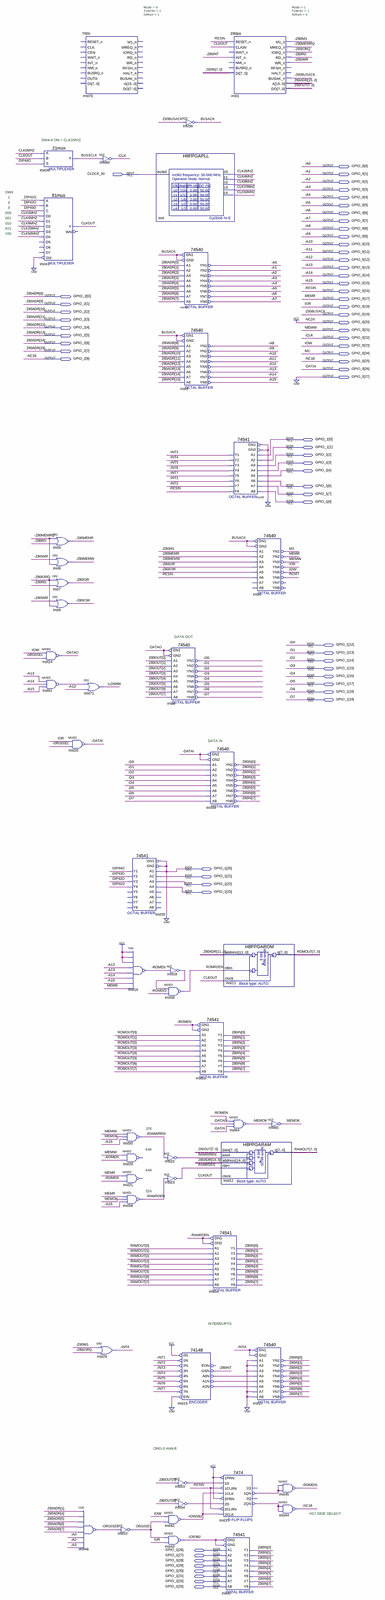
[diagram p0: schematic sheet, whole]
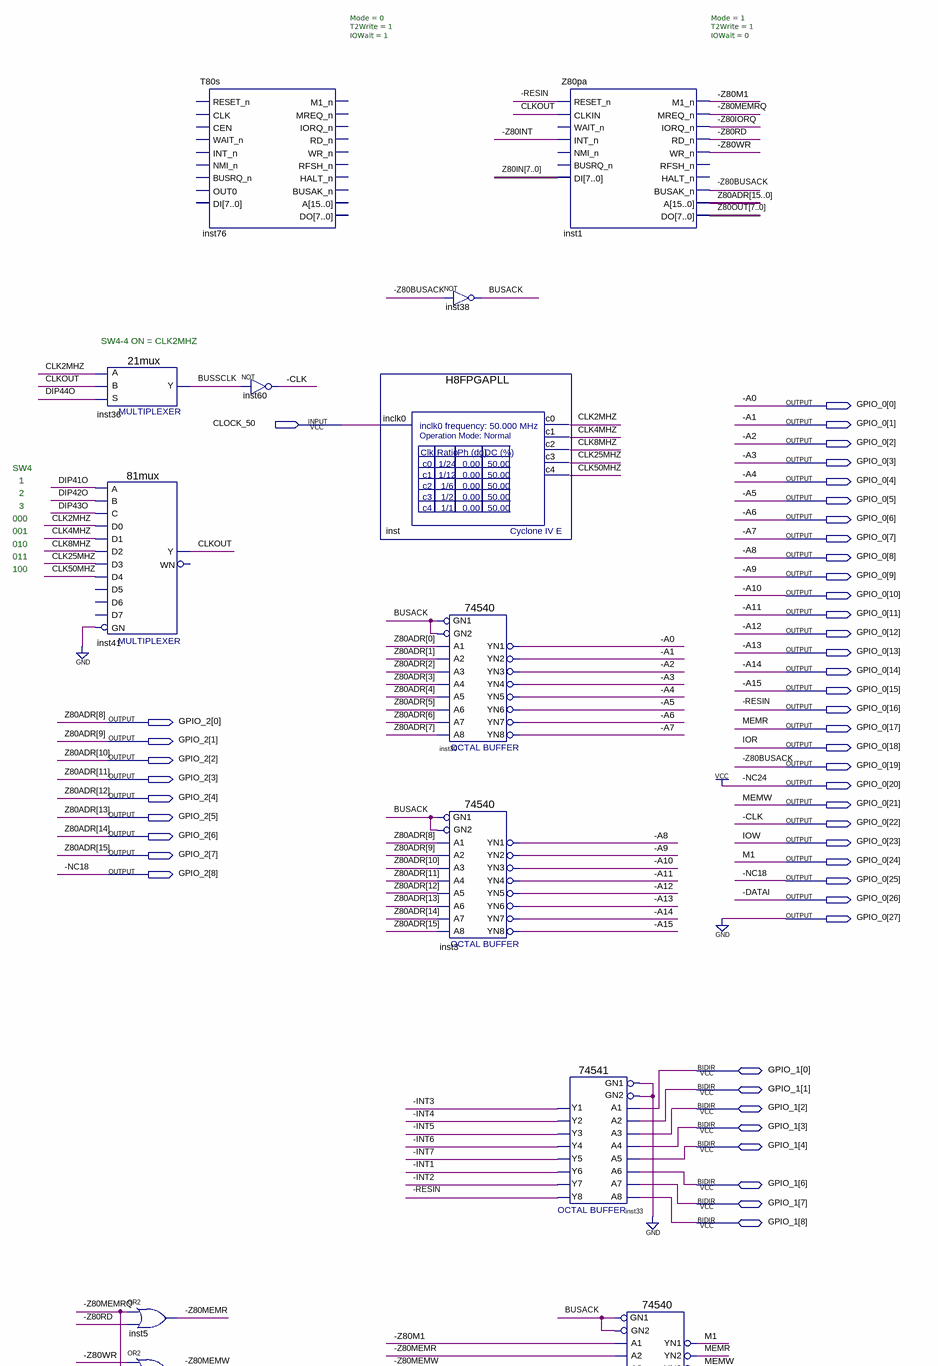
[diagram p1: schematic sheet, upper part]
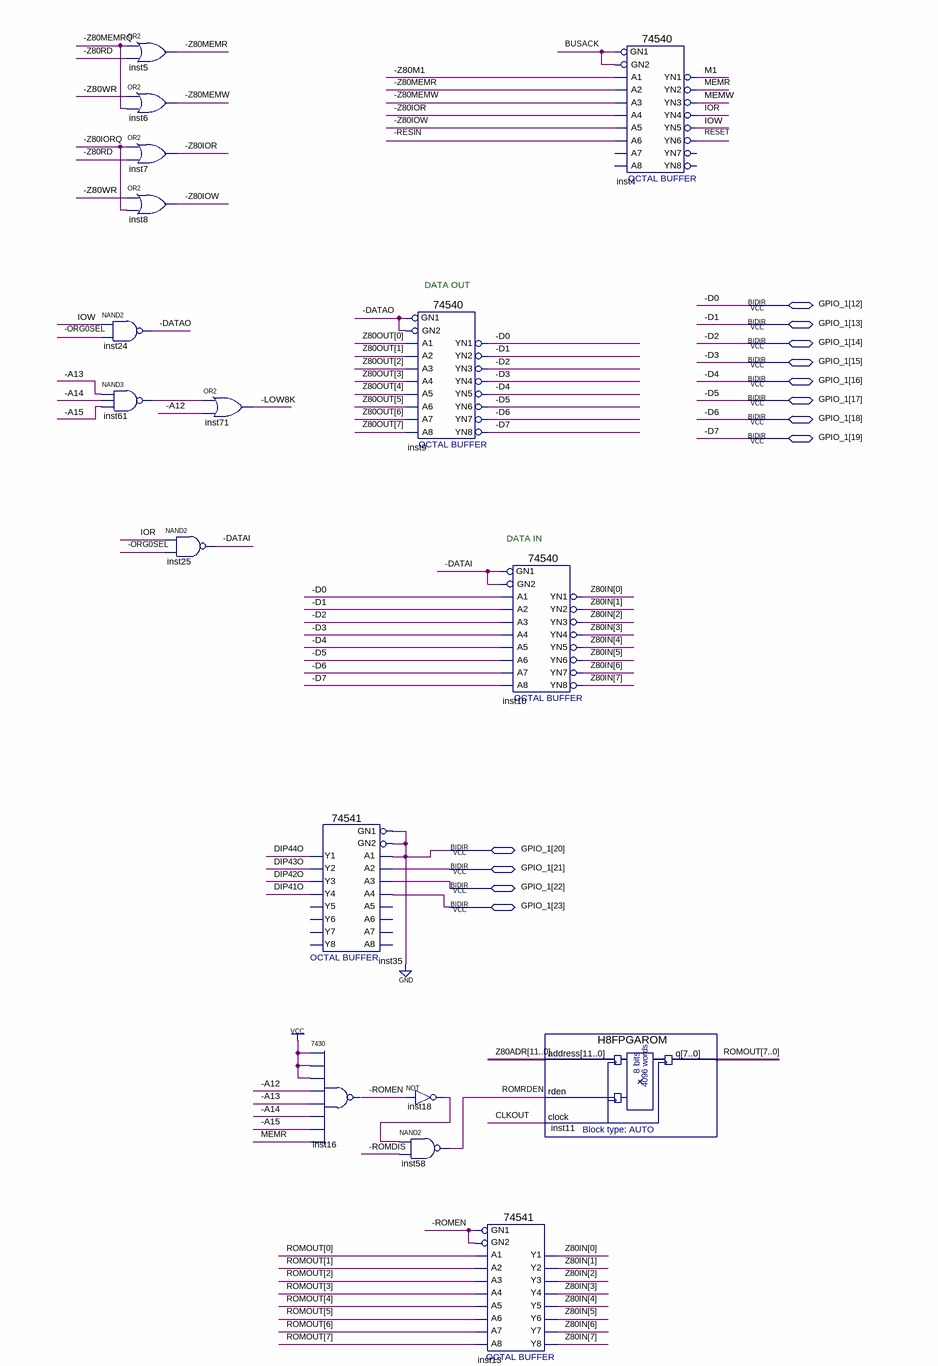
[diagram p2: schematic sheet, middle part]
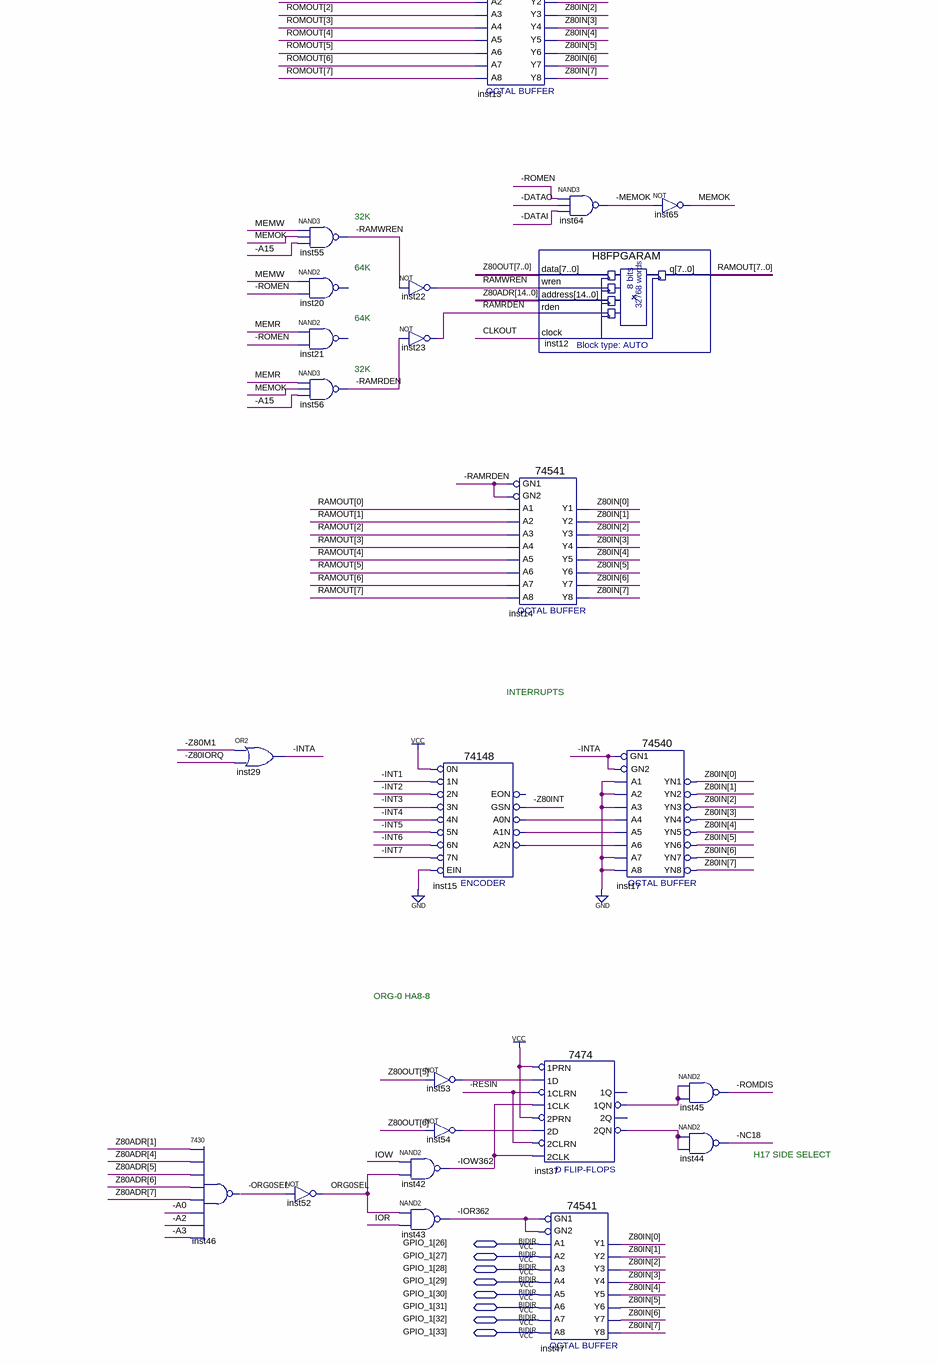
[diagram p3: schematic sheet, lower part]
// Quartus schematic H8FPGA.bdf as structural Verilog: 50 symbols, 66 pins
module H8FPGA (
  input  CLOCK_50,
  inout  [33:0] GPIO_1,
  output [27:0] GPIO_0,
  output [8:0] GPIO_2
);

  wire \-DATAO , \-INT1 , \-INT2 , \-INT3 , \-INT4 , \-INT5 , \-INT6 , \-INT7 , \-INTA , \-IOR362 ,
       \-IOW362 , \-LOW8K , \-MEMOK , \-ORG0SEL , \-RAMRDEN , \-RAMWREN , \-ROMDIS , \-ROMEN , \-Z80INT ,
       \-Z80IOR , \-Z80IORQ , \-Z80IOW , \-Z80M1 , \-Z80MEMR , \-Z80MEMRQ , \-Z80MEMW , \-Z80RD , \-Z80WR ,
       BUSACK, BUSSCLK, CLK2MHZ, CLK4MHZ, CLK8MHZ, CLK25MHZ, CLK50MHZ, CLKOUT, DIP41O, DIP42O, DIP43O,
       DIP44O, inst15_a0n, inst15_a1n, inst15_a2n, inst18_out, inst37_1qn, inst37_2qn, inst53_out,
       inst54_out, inst61_out, MEMOK, ORG0SEL, RAMRDEN, RAMWREN, RESET, ROMRDEN;
  wire [7:0] RAMOUT, ROMOUT, Z80ADR, Z80IN, Z80OUT;

  \21mux  inst36 (.S(DIP44O), .B(CLKOUT), .A(CLK2MHZ), .Y(BUSSCLK));
  \81mux  inst41 (
    .C(DIP43O), .D1(CLK4MHZ), .D0(CLK2MHZ), .D4(CLK50MHZ), .D2(CLK8MHZ), .D3(CLK25MHZ), .GN(1'b0),
    .A(DIP41O), .B(DIP42O), .Y(CLKOUT));  // open: D5, D7, D6, WN
  or inst5 (\-Z80MEMR , \-Z80MEMRQ , \-Z80RD );
  or inst6 (\-Z80MEMW , \-Z80WR , \-Z80MEMRQ );
  or inst7 (\-Z80IOR , \-Z80IORQ , \-Z80RD );
  or inst8 (\-Z80IOW , \-Z80WR , \-Z80IORQ );
  nand inst24 (\-DATAO , GPIO_0[23], \-ORG0SEL );
  nand inst61 (inst61_out, GPIO_0[13], GPIO_0[14], GPIO_0[15]);
  nand inst25 (GPIO_0[26], GPIO_0[18], \-ORG0SEL );
  T80s #(.Mode(0), .T2Write(1), .IOWait(1)) inst76 ();  // open: RESET_n, CLK, CEN, WAIT_n, INT_n, NMI_n, BUSRQ_n, OUT0, DI, M1_n, MREQ_n, IORQ_n, RD_n, WR_n, RFSH_n, HALT_n, BUSAK_n, A, DO
  or inst71 (\-LOW8K , inst61_out, GPIO_0[12]);
  or inst29 (\-INTA , \-Z80M1 , \-Z80IORQ );
  \7430  inst46 (
    .\9 (GPIO_0[3]), .\7 (GPIO_0[0]), .\8 (GPIO_0[2]), .\5 (Z80ADR[6]), .\2 (Z80ADR[1]), .\6 (Z80ADR[7]),
    .\3 (Z80ADR[4]), .\4 (Z80ADR[5]), .\1 (\-ORG0SEL ));
  not inst60 (GPIO_0[22], BUSSCLK);
  not inst52 (ORG0SEL, \-ORG0SEL );
  \74541  inst35 (
    .GN2(GPIO_1[20]), .A1(GPIO_1[20]), .A4(GPIO_1[23]), .A3(GPIO_1[22]), .A2(GPIO_1[21]), .GN1(GPIO_1[20]),
    .Y2(DIP43O), .Y3(DIP42O), .Y4(DIP41O), .Y1(DIP44O));  // open: A7, A6, A5, A8, Y8, Y5, Y6, Y7
  \7430  inst16 (
    .\9 (GPIO_0[17]), .\7 (GPIO_0[14]), .\8 (GPIO_0[15]), .\5 (GPIO_0[12]), .\2 (1'b1), .\6 (GPIO_0[13]),
    .\3 (1'b1), .\4 (1'b1), .\1 (\-ROMEN ));
  nand inst55 (\-RAMWREN , GPIO_0[21], MEMOK, GPIO_0[15]);
  // NAND2 inst20 has open pins: IN1=GPIO_0[21], IN2=\-ROMEN , OUT=open
  // NAND2 inst21 has open pins: IN1=GPIO_0[17], IN2=\-ROMEN , OUT=open
  nand inst56 (\-RAMRDEN , GPIO_0[17], MEMOK, GPIO_0[15]);
  H8FPGAPLL inst (.inclk0(CLOCK_50), .c0(CLK2MHZ), .c1(CLK4MHZ), .c2(CLK8MHZ), .c3(CLK25MHZ), .c4(CLK50MHZ));
  \74540  inst30 (
    .GN2(BUSACK), .GN1(BUSACK), .A1(Z80ADR[0]), .A2(Z80ADR[1]), .A5(Z80ADR[4]), .A4(Z80ADR[3]),
    .A3(Z80ADR[2]), .A8(Z80ADR[7]), .A7(Z80ADR[6]), .A6(Z80ADR[5]), .YN6(GPIO_0[5]), .YN7(GPIO_0[6]),
    .YN8(GPIO_0[7]), .YN3(GPIO_0[2]), .YN4(GPIO_0[3]), .YN5(GPIO_0[4]), .YN1(GPIO_0[0]), .YN2(GPIO_0[1]));
  \74540  inst3 (
    .GN2(BUSACK), .GN1(BUSACK), .A1(GPIO_2[0]), .A2(GPIO_2[1]), .A5(GPIO_2[4]), .A4(GPIO_2[3]),
    .A3(GPIO_2[2]), .A8(GPIO_2[7]), .A7(GPIO_2[6]), .A6(GPIO_2[5]), .YN6(GPIO_0[13]), .YN7(GPIO_0[14]),
    .YN8(GPIO_0[15]), .YN3(GPIO_0[10]), .YN4(GPIO_0[11]), .YN5(GPIO_0[12]), .YN1(GPIO_0[8]), .YN2(GPIO_0[9]));
  \74540  inst9 (
    .GN2(\-DATAO ), .GN1(\-DATAO ), .A1(Z80OUT[0]), .A2(Z80OUT[1]), .A5(Z80OUT[4]), .A4(Z80OUT[3]),
    .A3(Z80OUT[2]), .A8(Z80OUT[7]), .A7(Z80OUT[6]), .A6(Z80OUT[5]), .YN6(GPIO_1[17]), .YN7(GPIO_1[18]),
    .YN8(GPIO_1[19]), .YN3(GPIO_1[14]), .YN4(GPIO_1[15]), .YN5(GPIO_1[16]), .YN1(GPIO_1[12]), .YN2(GPIO_1[13]));
  not inst18 (inst18_out, \-ROMEN );
  nand inst58 (ROMRDEN, inst18_out, \-ROMDIS );
  not inst22 (RAMWREN, \-RAMWREN );
  not inst23 (RAMRDEN, \-RAMRDEN );
  \74148  inst15 (
    .\5N (\-INT5 ), .\0N (1'b1), .\1N (\-INT1 ), .\2N (\-INT2 ), .\3N (\-INT3 ), .\4N (\-INT4 ), .EIN(1'b0),
    .\6N (\-INT6 ), .\7N (\-INT7 ), .A1N(inst15_a1n), .A0N(inst15_a0n), .A2N(inst15_a2n), .GSN(\-Z80INT ));  // open: EON
  not inst53 (inst53_out, Z80OUT[5]);
  not inst54 (inst54_out, Z80OUT[6]);
  nand inst42 (\-IOW362 , GPIO_0[23], ORG0SEL);
  nand inst43 (\-IOR362 , ORG0SEL, GPIO_0[18]);
  not inst38 (BUSACK, GPIO_0[19]);
  \74541  inst13 (
    .GN2(\-ROMEN ), .A1(ROMOUT[0]), .A4(ROMOUT[3]), .A3(ROMOUT[2]), .A2(ROMOUT[1]), .A7(ROMOUT[6]),
    .A6(ROMOUT[5]), .A5(ROMOUT[4]), .GN1(\-ROMEN ), .A8(ROMOUT[7]), .Y8(Z80IN[7]), .Y5(Z80IN[4]),
    .Y6(Z80IN[5]), .Y7(Z80IN[6]), .Y2(Z80IN[1]), .Y3(Z80IN[2]), .Y4(Z80IN[3]), .Y1(Z80IN[0]));
  \74540  inst10 (
    .GN2(GPIO_0[26]), .GN1(GPIO_0[26]), .A1(GPIO_1[12]), .A2(GPIO_1[13]), .A5(GPIO_1[16]), .A4(GPIO_1[15]),
    .A3(GPIO_1[14]), .A8(GPIO_1[19]), .A7(GPIO_1[18]), .A6(GPIO_1[17]), .YN6(Z80IN[5]), .YN7(Z80IN[6]),
    .YN8(Z80IN[7]), .YN3(Z80IN[2]), .YN4(Z80IN[3]), .YN5(Z80IN[4]), .YN1(Z80IN[0]), .YN2(Z80IN[1]));
  H8FPGARAM inst12 (
    .data(Z80OUT), .wren(RAMWREN), .address({GPIO_2[6:0], Z80ADR}), .rden(RAMRDEN), .clock(CLKOUT), .q(RAMOUT));
  \74541  inst14 (
    .GN2(\-RAMRDEN ), .A1(RAMOUT[0]), .A4(RAMOUT[3]), .A3(RAMOUT[2]), .A2(RAMOUT[1]), .A7(RAMOUT[6]),
    .A6(RAMOUT[5]), .A5(RAMOUT[4]), .GN1(\-RAMRDEN ), .A8(RAMOUT[7]), .Y8(Z80IN[7]), .Y5(Z80IN[4]),
    .Y6(Z80IN[5]), .Y7(Z80IN[6]), .Y2(Z80IN[1]), .Y3(Z80IN[2]), .Y4(Z80IN[3]), .Y1(Z80IN[0]));
  \7474  inst37 (
    .\2D (inst54_out), .\2PRN (1'b1), .\1CLK (\-IOW362 ), .\1D (inst53_out), .\1PRN (1'b1),
    .\2CLK (\-IOW362 ), .\2CLRN (GPIO_0[16]), .\1CLRN (GPIO_0[16]), .\1QN (inst37_1qn), .\2QN (inst37_2qn));  // open: 2Q, 1Q
  \74541  inst47 (
    .GN2(\-IOR362 ), .A1(GPIO_1[26]), .A4(GPIO_1[29]), .A3(GPIO_1[28]), .A2(GPIO_1[27]), .A7(GPIO_1[32]),
    .A6(GPIO_1[31]), .A5(GPIO_1[30]), .GN1(\-IOR362 ), .A8(GPIO_1[33]), .Y8(Z80IN[7]), .Y5(Z80IN[4]),
    .Y6(Z80IN[5]), .Y7(Z80IN[6]), .Y2(Z80IN[1]), .Y3(Z80IN[2]), .Y4(Z80IN[3]), .Y1(Z80IN[0]));
  Z80pa #(.Mode(1), .T2Write(1), .IOWait(0)) inst1 (
    .RESET_n(GPIO_0[16]), .CLKIN(CLKOUT), .INT_n(\-Z80INT ), .DI(Z80IN), .M1_n(\-Z80M1 ),
    .MREQ_n(\-Z80MEMRQ ), .IORQ_n(\-Z80IORQ ), .RD_n(\-Z80RD ), .WR_n(\-Z80WR ), .BUSAK_n(GPIO_0[19]),
    .A({GPIO_2[7:0], Z80ADR}), .DO(Z80OUT));  // open: WAIT_n, NMI_n, BUSRQ_n, RFSH_n, HALT_n
  \74541  inst33 (
    .GN2(1'b0), .A1(GPIO_1[0]), .A4(GPIO_1[3]), .A3(GPIO_1[2]), .A2(GPIO_1[1]), .A7(GPIO_1[7]),
    .A6(GPIO_1[6]), .A5(GPIO_1[4]), .GN1(1'b0), .A8(GPIO_1[8]), .Y8(GPIO_0[16]), .Y5(\-INT7 ), .Y6(\-INT1 ),
    .Y7(\-INT2 ), .Y2(\-INT4 ), .Y3(\-INT5 ), .Y4(\-INT6 ), .Y1(\-INT3 ));
  H8FPGAROM inst11 (.address({GPIO_2[3:0], Z80ADR}), .rden(ROMRDEN), .clock(CLKOUT), .q(ROMOUT));
  nand inst64 (\-MEMOK , \-ROMEN , \-DATAO , GPIO_0[26]);
  \74540  inst4 (
    .GN2(BUSACK), .GN1(BUSACK), .A1(\-Z80M1 ), .A2(\-Z80MEMR ), .A5(\-Z80IOW ), .A4(\-Z80IOR ),
    .A3(\-Z80MEMW ), .A6(GPIO_0[16]), .YN6(RESET), .YN3(GPIO_0[21]), .YN4(GPIO_0[18]), .YN5(GPIO_0[23]),
    .YN1(GPIO_0[24]), .YN2(GPIO_0[17]));  // open: A8, A7, YN7, YN8
  \74540  inst17 (
    .GN2(\-INTA ), .GN1(\-INTA ), .A1(1'b0), .A2(1'b0), .A5(inst15_a1n), .A4(inst15_a0n), .A3(1'b0),
    .A8(1'b0), .A7(1'b0), .A6(inst15_a2n), .YN6(Z80IN[5]), .YN7(Z80IN[6]), .YN8(Z80IN[7]), .YN3(Z80IN[2]),
    .YN4(Z80IN[3]), .YN5(Z80IN[4]), .YN1(Z80IN[0]), .YN2(Z80IN[1]));
  not inst65 (MEMOK, \-MEMOK );
  nand inst45 (\-ROMDIS , inst37_1qn, inst37_1qn);
  nand inst44 (GPIO_0[25], inst37_2qn, inst37_2qn);

  assign {GPIO_0[27], GPIO_0[20]} = 2'b01;
  assign GPIO_2[8] = GPIO_0[25];
  // also tied to GND on the sheet: GPIO_1[20]

  // Other names for the same wires on the sheet: -A0 = GPIO_0[0]; -A1 = GPIO_0[1]; -A2 = GPIO_0[2]; -A3 = GPIO_0[3];
  //   -A4 = GPIO_0[4]; -A5 = GPIO_0[5]; -A6 = GPIO_0[6]; -A7 = GPIO_0[7]; -A8 = GPIO_0[8]; -A9 = GPIO_0[9];
  //   -A10 = GPIO_0[10]; -A11 = GPIO_0[11]; -A12 = GPIO_0[12]; -A13 = GPIO_0[13]; -A14 = GPIO_0[14];
  //   -A15 = GPIO_0[15]; -CLK = GPIO_0[22]; -D0 = GPIO_1[12]; -D1 = GPIO_1[13]; -D2 = GPIO_1[14]; -D3 = GPIO_1[15];
  //   -D4 = GPIO_1[16]; -D5 = GPIO_1[17]; -D6 = GPIO_1[18]; -D7 = GPIO_1[19]; -DATAI = GPIO_0[26]; -NC18 = GPIO_0[25];
  //   -RESIN = GPIO_0[16]; -Z80BUSACK = GPIO_0[19]; IOR = GPIO_0[18]; IOW = GPIO_0[23]; M1 = GPIO_0[24];
  //   MEMR = GPIO_0[17]; MEMW = GPIO_0[21]; Z80ADR[15:8] = GPIO_2[7:0]

  // Notes on the sheet:
  //   SW4-4 ON = CLK2MHZ
  //   SW4
  //   1
  //   2
  //   3
  //   000
  //   001
  //   010
  //   011
  //   100
  //   DATA OUT
  //   DATA IN
  //   32K
  //   64K
  //   64K
  //   32K
  //   INTERRUPTS
  //   ORG-0 HA8-8
  //   H17 SIDE SELECT
endmodule
